# EasyEDA Pro project 23年e题定制扩展版.epro

# Schematic Schematic1_1
Board Name: Board1_1; Create Date: 2025-07-27; Page Name: P1; Project Name: STM32F103舵机底板; Schematic Name: Schematic1_1; Update Date: 2025-07-27; Company: 嘉立创EDA; Page Size: A4; Version: V1.0
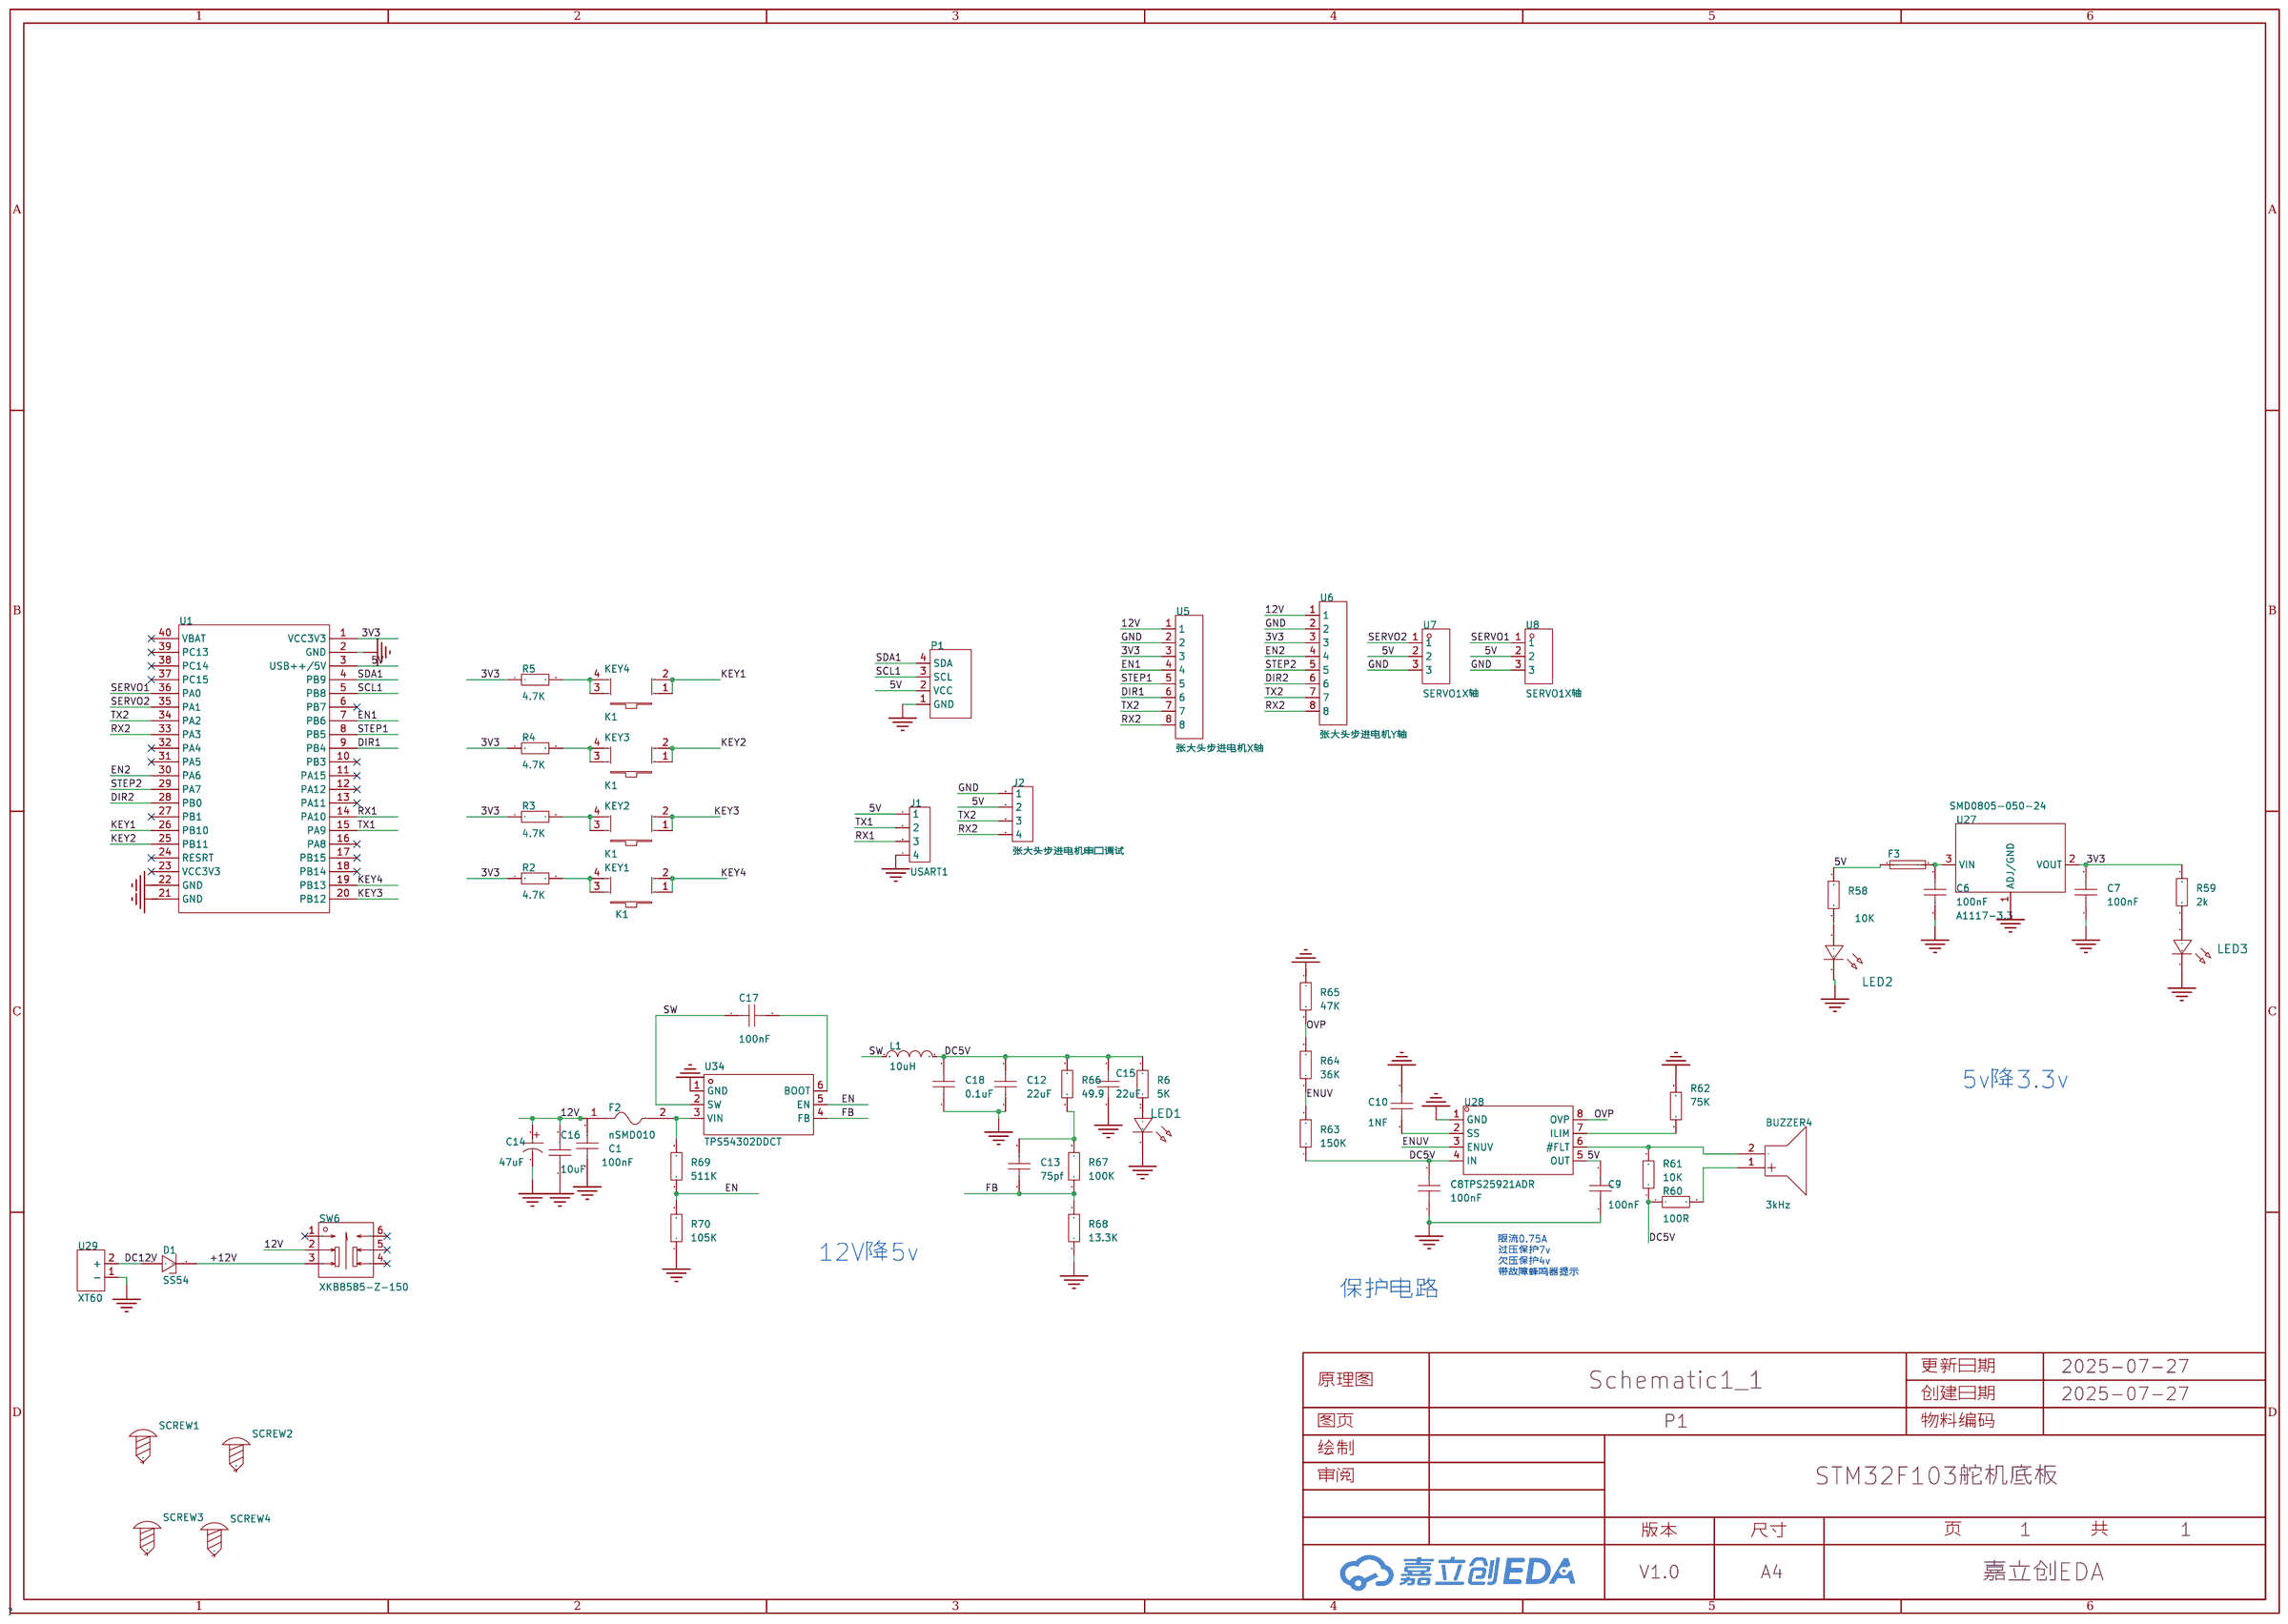
[diagram p0: schematic sheet]

## Parts
BUZZER4  3kHz  [BUZ-TH_BD9.0-P5.00-D0.6-FD]
C1  100nF  [C0805]
C6  100nF  [C0603]
C7  100nF  [C0603]
C8  100nF  [C0603]
C9  100nF  [C0603]
C10  1NF  [C0603]
C12  22uF  [C0603]
C13  75pf  [C0603]
C14  47uF  [CAP-TH_BD5.0-P2.00-D0.8-FD]
C15  22uF  [C0603]
C16  10uF  [C0805]
C17  100nF  [C0805]
C18  0.1uF  [C0603]
D1  SS54  [SMA_L4.3-W2.6-LS5.0-FD]
F2  nSMD010  [F1206]
F3  SMD0805-050-24  [F0805]
J1  USART1  [XH2.54-4PIN]
J2  张大头步进电机串口调试  [XH2.54-4PIN]
KEY1  K1  [KEY-TH_4P-L6.0-W6.0-P4.50]
KEY2  K1  [KEY-TH_4P-L6.0-W6.0-P4.50]
KEY3  K1  [KEY-TH_4P-L6.0-W6.0-P4.50]
KEY4  K1  [KEY-TH_4P-L6.0-W6.0-P4.50]
L1  10uH  [IND-SMD_L4.0-W4.0]
LED1  -  [LED_0805]
LED2  -  [LED_0603]
LED3  -  [LED_0603]
P1  -  [OLED-0.96]
R2  4.7K  [R0603]
R3  4.7K  [R0603]
R4  4.7K  [R0603]
R5  4.7K  [R0603]
R6  5K  [r0603]
R58  10K  [R0603]
R59  2k  [R0603]
R60  100R  [R0603]
R61  10K  [R0603]
R62  75K  [R0603]
R63  150K  [R0603]
R64  36K  [R0603]
R65  47K  [R0603]
R66  49.9  [r0603]
R67  100K  [r0603]
R68  13.3K  [r0603]
R69  511K  [r0603]
R70  105K  [r0603]
SCREW1  -  [M3螺丝]
SCREW2  -  [M3螺丝]
SCREW3  -  [M3螺丝]
SCREW4  -  [M3螺丝]
SW6  XKB8585-Z-150  [SW-TH_6P-L8.5-W8.5-P2.50-LS5.4-BL-1_1]
U1  -  [STM32F103C8T6直插]
U5  张大头步进电机X轴  [CONN-TH_8P-P2.54_XH2.54_C9900012080]
U6  张大头步进电机Y轴  [CONN-TH_8P-P2.54_XH2.54_C9900012080]
U7  SERVO1X轴  [CONN-TH_XH2.54_3PIN_1]
U8  SERVO1X轴  [CONN-TH_XH2.54_3PIN_1]
U27  A1117-3.3  [SOT-223-3_L6.5-W3.4-P2.30-LS7.0-BR-1]
U28  TPS25921ADR  [SOIC-8_L5.0-W4.0-P1.27-LS6.0-BL]
U29  XT60  [CONN-TH_XT60]
U34  TPS54302DDCT  [TSOT-23-6_L2.9-W1.6-P0.95-LS2.8-BR]

## Library data of the parts
BUZZER4 = HNB09A03: 驱动方式:有源(内含驱动线路);构造类型:电磁式;频率:3kHz;声压(SPL):85dB;; LCSC Part Name: 电磁式有源一体蜂鸣器HNB09A03; Supplier Part: C96102; Manufacturer: 华能; Supplier Footprint: 插件,D=9mm; JLCPCB Part Class: 扩展库; Datasheet: https://atta.szlcsc.com/upload/public/pdf/source/20241128/61C4C8C3938BB25F7C38FBE94CCE8DCF.pdf; Supplier: LCSC; Driver Circuitry: 有源(内含驱动线路); Technology: 电磁式; Voltage - Supply: 1.5V~4.5V; Current Consumption: 30mA; Sound Pressure Level(SPL): 85dB; Diameter(φD): 9mm; Height: 5.5mm; Operating Temperature: -20℃~+70℃
C1 C13 C16 C17 = CAP_0805: Supplier Footprint: 0805
C6-C10 C12 C15 C18 = CAP_0603: Supplier Footprint: 0603
C14 = EWH1VM470D11OT: 容值:47uF;精度:±20%;额定电压:35V;纹波电流:90mA@120Hz;等效串联电阻:-;; LCSC Part Name: 47uF ±20% 35V; Supplier Part: C105335; Manufacturer: AISHI(艾华集团); Supplier Footprint: 插件,D5xL11mm; Datasheet: https://atta.szlcsc.com/upload/public/pdf/source/20200106/C481308_16D735F9103482ADD8491C667D201AFA.pdf; Supplier: LCSC; Tolerance: ±20%; Rated Voltage: 35V; Ripple Current: 90mA@120Hz; Lead Spacing: 2mm; φD: 5mm; L: 11mm; Lifetime @ Temp: 2000hrs@105℃
D1 = SS54_C7420369: 二极管配置:独立式;正向压降(Vf):550mV@5.0A;直流反向耐压(Vr):40V;整流电流:5A;; LCSC Part Name: 电压:40V 电流:5A; Supplier Part: C7420369; Manufacturer: 宏迦橙; Supplier Footprint: SMA(DO-214AC); Datasheet: https://atta.szlcsc.com/upload/public/pdf/source/20230828/254C3882F8647358AD9F60DD73611B5E.pdf; Supplier: LCSC; Diode Configuration: 独立式; Forward Voltage (Vf@If): 550mV@5.0A; Reverse Voltage (Vr): 40V; Rectified Current: 5A; Reverse Leakage Current (Ir): 50uA@40V
F2 = nSMD010: 耐压:60V;最大电流:40A;保持电流(Ih):100mA;跳闸电流:250mA;; LCSC Part Name: 0.10A 60V 自恢复保险丝; Supplier Part: C70065; Manufacturer: 台湾陆海; Supplier Footprint: 1206; Datasheet: https://atta.szlcsc.com/upload/public/pdf/source/20230404/ADB19886462D98F83AD677B1F8114E76.pdf; Supplier: LCSC; Voltage - Max: 60V; Current - Max: 40A; Hold Current: 100mA; Trip Current: 250mA; Power Dissipation: -；-；-；-; Operating Temperature: -40℃~+85℃
F3 = SMD0805-050-24: 耐压(Vmax):24V;最大电流(Imax):40A;保持电流(Ihold):500mA;跳闸电流(Itrip):1A;; Supplier Part: C46640987; Manufacturer: 宏嘉诚; Supplier Footprint: 0805; JLCPCB Part Class: 扩展库; Datasheet: https://atta.szlcsc.com/upload/public/pdf/source/20250414/C7C75E40B18789A4A1352E9E468D2637.pdf; Supplier: LCSC; Voltage - Max: 24V; Current - Max: 40A; Hold Current: 500mA; Trip Current: 1A; Power Dissipation: 500mW; Resistance - Initial (Ri) (Min): 100mΩ; Resistance - Post Trip (R1) (Max): 850mΩ; Time to Trip(Max): 100ms; Operating Temperature: -40℃~+85℃
J1 J2 = XH2.54-4PIN: Connector  F=2.54mm  4PIN  插件; Manufacturer: Megastar(兆星); Manufacturer Part: ZX-XH2.54-4PZZ; Supplier: LCSC; Supplier Part: C7429634
KEY1-KEY4 = 按键开关6*6*8.5: LCSC Part Name: 按键开关6*6*8.5   直插; Supplier Part: C59980; Supplier Footprint: 插件; JLCPCB Part Class: 扩展库; Supplier: LCSC
L1 = SWPA4030S100MT: 电感值:10uH;精度:±20%;额定电流:1.5A;饱和电流(Isat):2.4A;类型:-;; LCSC Part Name: 10uH ±20% 2.4A; Supplier Part: C38117; Manufacturer: Sunlord(顺络); Supplier Footprint: SMD,4x4mm; Datasheet: https://atta.szlcsc.com/upload/public/pdf/source/20231024/317626D2AA2F8AB4113C1875E432E6E1.pdf; Supplier: LCSC; Tolerance: ±20%; Rated Current: 1.5A; Current - Saturation(Isat): 2.4A; DC Resistance(DCR): 130mΩ
LED1 = LED_0805-R: Supplier Footprint: 0805
LED2 LED3 = LED_0603-R: Supplier Footprint: 0603
P1 = OLED0.96_1: Supplier: Add New Supplier
R2-R5 = 0603WAF4992T5E: 电阻类型:厚膜电阻;阻值:49.9kΩ;精度:±1%;功率:100mW;最大工作电压:75V;温度系数:±100ppm/℃;; LCSC Part Name: 49.9kΩ ±1% 100mW 厚膜电阻; Supplier Part: C23184; Manufacturer: UNI-ROYAL(厚声); Supplier Footprint: 0603; JLCPCB Part Class: 基础库; Datasheet: https://atta.szlcsc.com/upload/public/pdf/source/20200306/C422600_1E6D84923E4A46A82E41ADD87F860B5C.pdf; Supplier: LCSC; Type: 厚膜电阻; Tolerance: ±1%; Power(Watts): 100mW; Overload Voltage (Max): 75V; Temperature Coefficient: ±100ppm/℃; Operating Temperature Range: -55℃~+155℃
R6 R66-R70 = Res_0805: Supplier Footprint: 0805
R58-R65 = Res_0603: Supplier Footprint: 0603
SCREW1-SCREW4 = M3螺丝: Supplier Footprint: 插件
SW6 = XKB8585-Z-150_1: 电路结构:-;自锁/无锁:自锁;安装方式:直插;触点电流:100mA;额定电压 (AC):250V;额定电压 (DC):30V;带灯:不带;作用力:160gf;机械寿命:10万次;; LCSC Part Name: 按键开关   六脚 内扣 有声自锁; Supplier Part: C318850; Manufacturer: XKB Connectivity(中国星坤); Supplier Footprint: 插件; JLCPCB Part Class: 扩展库; Datasheet: https://atta.szlcsc.com/upload/public/pdf/source/20200227/C318850_BEC742BC33DEE736D7E5FB22B903A157.pdf; Supplier: LCSC; Self Lock / No Lock: 自锁; Actuator Style: 方形按钮; Mounting Style: 直插; Contact Current: 100mA; Voltage Rating (AC): 250V; Voltage Rating (DC): 30V; Insulation Resistance: 100MΩ; Actuator/Cap Color: 白色; With Lamp: 不带; Pin Style: PC引脚; Operating Force: 160gf; Operating Temperature: -15℃~+55℃; Mechanical Life: 10万次
U1 = STM32F103C8T6直插
U5 U6 = XH2.54-8PIN: Supplier Part: C9900014929; Supplier Footprint: JP8; JLCPCB Part Class: 扩展库; Supplier: LCSC
U7 U8 = XH2.54_3PIN_立式: Supplier Part: C9900001961; Supplier Footprint: CONN-TH_3P-P2.54-L10.0-W5.8; JLCPCB Part Class: 扩展库; Supplier: LCSC
U27 = A1117-3.3: 输出电流:1A;; LCSC Part Name: AMS1117-3.3; Supplier Part: C7432020; Manufacturer: IDCHIP(英锐芯); Supplier Footprint: SOT-223; JLCPCB Part Class: 扩展库; Datasheet: https://atta.szlcsc.com/upload/public/pdf/source/20230625/435FEEFA02C0FE449E7397A11F8448E0.pdf; Supplier: LCSC; Output Current: 1A; Features: 热关断(TSD)；过流保护(OCP)
U28 = TPS25921ADR: TPS25921A 具有自动重试故障响应功能的 4.5V 至 18V、90mΩ、0.4A 至 1.6A 电子保险丝; Supplier Part: C189199; Manufacturer: TI(德州仪器); Supplier Footprint: SOIC-8; JLCPCB Part Class: 扩展库; Datasheet: https://www.ti.com/cn/lit/gpn/tps25921a; Supplier: LCSC
U29 = XT60: 类别:-;类型1:-;; LCSC Part Name: AMASS(艾迈斯) XT60模型插头 3.5mm镀金香蕉头公头（电调端）XT60-M; Supplier Part: C98733; Manufacturer: AMASS(艾迈斯); JLCPCB Part Class: 扩展库; Datasheet: https://atta.szlcsc.com/upload/public/pdf/source/20170606/1496716524919.pdf; Supplier: LCSC; Type: 香蕉头; Colour: 黄色; InterfaceType: 公头; specifications: 3.5mm
U34 = TPS54302DDCT: 功能类型:降压型;输出类型:可调;工作电压:4.5V~28V;输出电压:596mV~28V;输出电流:3A;; LCSC Part Name: 4.5V至28V输入,3A输出,低EMI同步降压转换器; Supplier Part: C129370; Manufacturer: TI(德州仪器); Supplier Footprint: TSOT-23-6; JLCPCB Part Class: 扩展库; Datasheet: https://www.ti.com/cn/lit/gpn/tps54302; Supplier: LCSC; Function: 降压型; Output Type: 可调; Input Voltage: 4.5V~28V; Output Voltage: 596mV~28V; Output Current: 3A; Switching Frequency: 400kHz; Operating Temperature: -40℃~+125℃@(TJ); Synchronous Rectification: 是; Number of Outputs: 1; Topology: 降压式; Switch tube (built-in/external): 内置

## Nets
3V3: C7.2 R2.1 R3.1 R4.1 R5.1 R59.2 U1.1(VCC3V3) U5.3 U6.3 U27.2(VOUT)
5V: C9.2 F3.1 J1.1 J2.2 P1.2(VCC) R58.2 U1.3(USB++/5V) U7.2 U8.2 U28.5(OUT)
12V: C1.2 C14.1 C16.2 F2.1 SW6.2 U5.1 U6.1
+12V: D1.2(K) SW6.3
GND: C1.1 C6.1 C7.1 C8.1 C9.1 C10.1 C12.1 C14.2 C15.1 C16.1 C18.1 J1.4 J2.1 LED1.1(C) LED2.1(C) LED3.1(C) P1.1(GND) R62.2 R65.1 R68.1 R70.1 U1.2(GND) U1.21(GND) U1.22(GND) U5.2 U6.2 U7.3 U8.3 U27.1(ADJ/GND) U28.1(GND) U29.1(-) U34.1(GND)
DC5V: C8.2 C12.2 C15.2 C18.2 L1.2 R6.2 R60.1 R61.1 R63.1 R66.2 U28.4(IN)
DC12V: D1.1(A) U29.2(+)
DIR1: U1.9(PB4) U5.6
DIR2: U1.28(PB0) U6.6
EN: R69.1 R70.2 U34.5(EN)
EN1: U1.7(PB6) U5.4
EN2: U1.30(PA6) U6.4
ENUV: R63.2 R64.1 U28.3(ENUV)
FB: C13.1 R67.1 R68.2 U34.4(FB)
KEY1: KEY4.1 KEY4.2 U1.26(PB10)
KEY2: KEY3.1 KEY3.2 U1.25(PB11)
KEY3: KEY2.1 KEY2.2 U1.20(PB12)
KEY4: KEY1.1 KEY1.2 U1.19(PB13)
OVP: R64.2 R65.2 U28.8(OVP)
RX1: J1.3 U1.14(PA10)
RX2: J2.4 U1.33(PA3) U5.8 U6.8
SCL1: P1.3(SCL) U1.5(PB8)
SDA1: P1.4(SDA) U1.4(PB9)
SERVO1: U1.36(PA0) U8.1
SERVO2: U1.35(PA1) U7.1
STEP1: U1.8(PB5) U5.5
STEP2: U1.29(PA7) U6.5
SW: C17.1 L1.1 U34.2(SW)
TX1: J1.2 U1.15(PA9)
TX2: J2.3 U1.34(PA2) U5.7 U6.7
$BUZZER4_1: BUZZER4.1(+) R60.2
$BUZZER4_2: BUZZER4.2(-) R61.2 U28.6(#FLT)
$C6_2: C6.2 F3.2 U27.3(VIN)
$C10_2: C10.2 U28.2(SS)
$C13_2: C13.2 R66.1 R67.2
$C17_2: C17.2 U34.6(BOOT)
$F2_2: F2.2 R69.2 U34.3(VIN)
$KEY1_3: KEY1.3 KEY1.4 R2.2
$KEY2_3: KEY2.3 KEY2.4 R3.2
$KEY3_3: KEY3.3 KEY3.4 R4.2
$KEY4_3: KEY4.3 KEY4.4 R5.2
$R62_1: R62.1 U28.7(ILIM)
Net-(LED1-2): LED1.2(A) R6.1
Net-(LED2-2): LED2.2(A) R58.1
Net-(LED3-2): LED3.2(A) R59.1

Not connected (* = marked no-connect by the designer): SCREW1 1; SCREW2 1; SCREW3 1; SCREW4 1; SW6 1* 4* 5* 6*; U1 6(PB7)* 10(PB3)* 11(PA15)* 12(PA12)* 13(PA11)* 16(PA8)* 17(PB15)* 18(PB14)* 23(VCC3V3)* 24(RESRT)* 27(PB1)* 31(PA5)* 32(PA4)* 37(PC15)* 38(PC14)* 39(PC13)* 40(VBAT)*

## Notes on the sheet
- 5v降3.3v
- 12V降5v
- 限流0.75A
  过压保护7v
  欠压保护4v
  带故障蜂鸣器提示
- 保护电路
